# EAGLE design GMSN Pure Power (EAGLE 8.2.1)
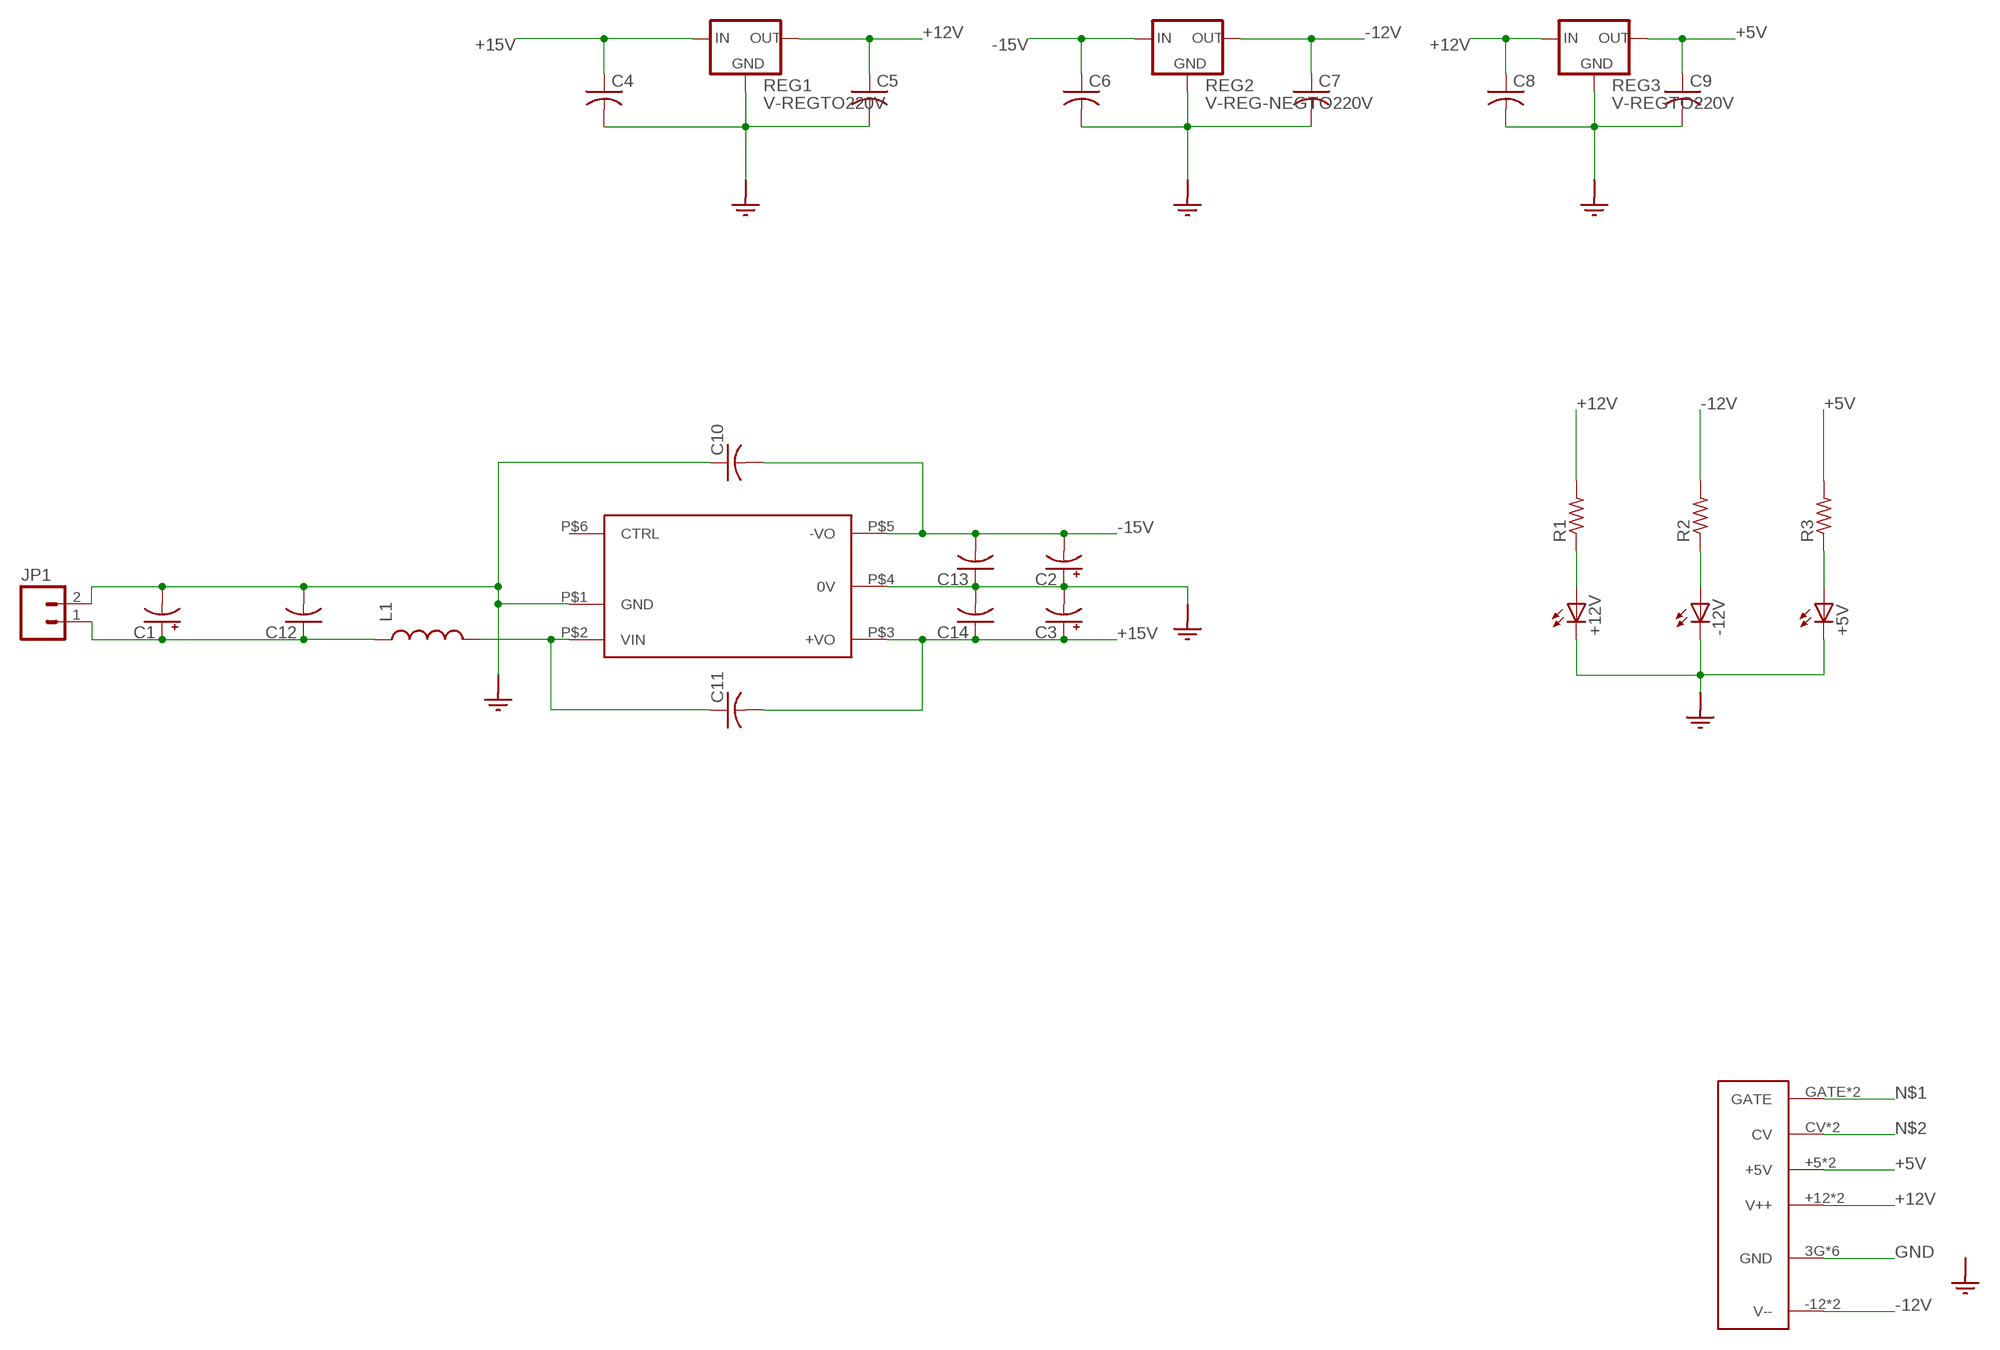
[diagram p0: schematic, sheet 1]

## Parts
+5V  LED5MM  [LED5MM]
+12V  LED5MM  [LED5MM]
-12V  LED5MM  [LED5MM]
C1  CPOL-USSANYO_D  [SANYO-OSCON_D]
C2  CPOL-USSANYO_D  [SANYO-OSCON_D]
C3  CPOL-USSANYO_D  [SANYO-OSCON_D]
C4  C-US025-024X044  [C025-024X044]
C5  C-US025-024X044  [C025-024X044]
C6  C-US025-024X044  [C025-024X044]
C7  C-US025-024X044  [C025-024X044]
C8  C-US025-024X044  [C025-024X044]
C9  C-US025-024X044  [C025-024X044]
C10  C-US025-024X044  [C025-024X044]
C11  C-US025-024X044  [C025-024X044]
C12  C-US025-024X044  [C025-024X044]
C13  C-US025-024X044  [C025-024X044]
C14  C-US025-024X044  [C025-024X044]
JP1  M02LOCK  [1X02_LOCK]
L1  INDUCTORAXIAL-0.6  [AXIAL-0.6]
R1  R-US_0207/10  [0207/10]
R2  R-US_0207/10  [0207/10]
R3  R-US_0207/10  [0207/10]
REG1  V-REGTO220V  [TO220V]
REG2  V-REG-NEGTO220V  [TO220V]
REG3  V-REGTO220V  [TO220V]
U$1  URA241XLD-20WR3  [URA241XLD-20WR3]
U$11  EURO_POWER_16  [POWER_SHROUDED]

## Nets
+5V: C9.1 R3.2 REG3.3(OUT) U$11.+5(+5V) U$11.+5A(+5V)
+12V: C5.1 C8.1 R1.2 REG1.3(OUT) REG3.1(IN) U$11.+12(V++) U$11.+12A(V++)
+15V: C3.+ C4.1 C11.2 C14.1 REG1.1(IN) U$1.P$3(+VO)
-12V: C7.1 R2.2 REG2.3(OUT) U$11.-12(V--) U$11.-12A(V--)
-15V: C2.- C6.1 C10.2 C13.2 REG2.2(IN) U$1.P$5(-VO)
GND: +5V.K(C) +12V.K(C) -12V.K(C) C1.- C2.+ C3.- C4.2 C5.2 C6.2 C7.2 C8.2 C9.2 C10.1 C12.2 C13.1 C14.2 JP1.2 REG1.2(GND) REG2.1(GND) REG3.2(GND) U$1.P$1(GND) U$1.P$4(0V) U$11.3G(GND) U$11.4G(GND) U$11.5G(GND) U$11.6G(GND) U$11.7G(GND) U$11.8G(GND)
N$1: U$11.GATE U$11.GATEA(GATE)
N$2: U$11.CV U$11.CVA(CV)
N$3: C11.1 L1.P$2 U$1.P$2(VIN)
N$4: +12V.A R1.1
N$5: -12V.A R2.1
N$6: +5V.A R3.1
N$7: C1.+ C12.1 JP1.1 L1.P$1
Unconnected: U$1.P$6(CTRL)

## Library data of the parts
+5V +12V -12V = GMSN:LED: LED OSRAM: - CHIPLED LG R971, LG N971, LY N971, LG Q971, LY Q971, LO R971, LY R971 LH N974, LH R974 LS Q976, LO Q976, LY Q976 LO Q996 - Hyper CHIPLED LW Q18S LB Q993, LB Q99A, LB R99A - SideLED LS A670, LO A670, LY A670, LG A670, LP A670 LB A673, LV A673, LT A673, LW A673 LH A674 LY A675 LS A676, LA A676, LO A676, LY A676, LW A676 LS A679, LY A679, LG A679 - Hyper Micro SIDELED® LS Y876, LA Y876, LO Y876, LY Y876 LT Y87S - SmartLED LW L88C, LW L88S LB L89C, LB L89S, LG L890 LS L89K, LO L89K, LY L89K LS L896, LA L896, LO L896, LY L896 - TOPLED LS T670, LO T670, LY T670, LG T670, LP T670 LSG T670, LSP T670, LSY T670, LOP T670, LYG T670 LG T671, LOG T671, LSG T671 LB T673, LV T673, LT T673, LW T673 LH T674 LS T676, LA T676, LO T676, LY T676, LB T676, LH T676, LSB T676, LW T676 LB T67C, LV T67C, LT T67C, LS T67K, LO T67K, LY T67K, LW E67C LS E67B, LA E67B, LO E67B, LY E67B, LB E67C, LV E67C, LT E67C LW T67C LS T679, LY T679, LG T679 LS T770, LO T770, LY T770, LG T770, LP T770 LB T773, LV T773, LT T773, LW T773 LH T774 LS E675, LA E675, LY E675, LS T675 LS T776, LA T776, LO T776, LY T776, LB T776 LHGB T686 LT T68C, LB T68C - Hyper Mini TOPLED® LB M676 - Mini TOPLED Santana® LG M470 LS M47K, LO M47K, LY M47K Source: http://www.osram.convergy.de/
C1-C3 = GMSN:CPOL-US: POLARIZED CAPACITOR, American symbol
C4-C14 = GMSN:C-US: CAPACITOR, American symbol
JP1 = GMSN:M02: Standard 2-pin 0.1" header. Use with - straight break away headers ( PRT-00116) - right angle break away headers (PRT-00553) - swiss pins (PRT-00743) - machine pins (PRT-00117) - female headers (PRT-00115) Molex polarized connector foot print use with: PRT-08233 with associated crimp pins and housings. 2.54_SCREWTERM for use with PRT-10571. 3.5mm Screw Terminal footprints for PRT-08084 5mm Screw Terminal footprints for use with PRT-08433
L1 = GMSN:INDUCTOR: Inductors Basic Inductor/Choke - 0603 and 1206. Footprints are not proven and vary greatly between part numbers. SRN6045- 33uH, 20% 1.4A
R1-R3 = GMSN:R-US_: RESISTOR, American symbol
REG1 REG3 = GMSN:V-REG
REG2 = GMSN:V-REG-NEG
U$1 = GMSN:URA241XLD-20WR3
U$11 = GMSN:EURO_POWER_16

## Board
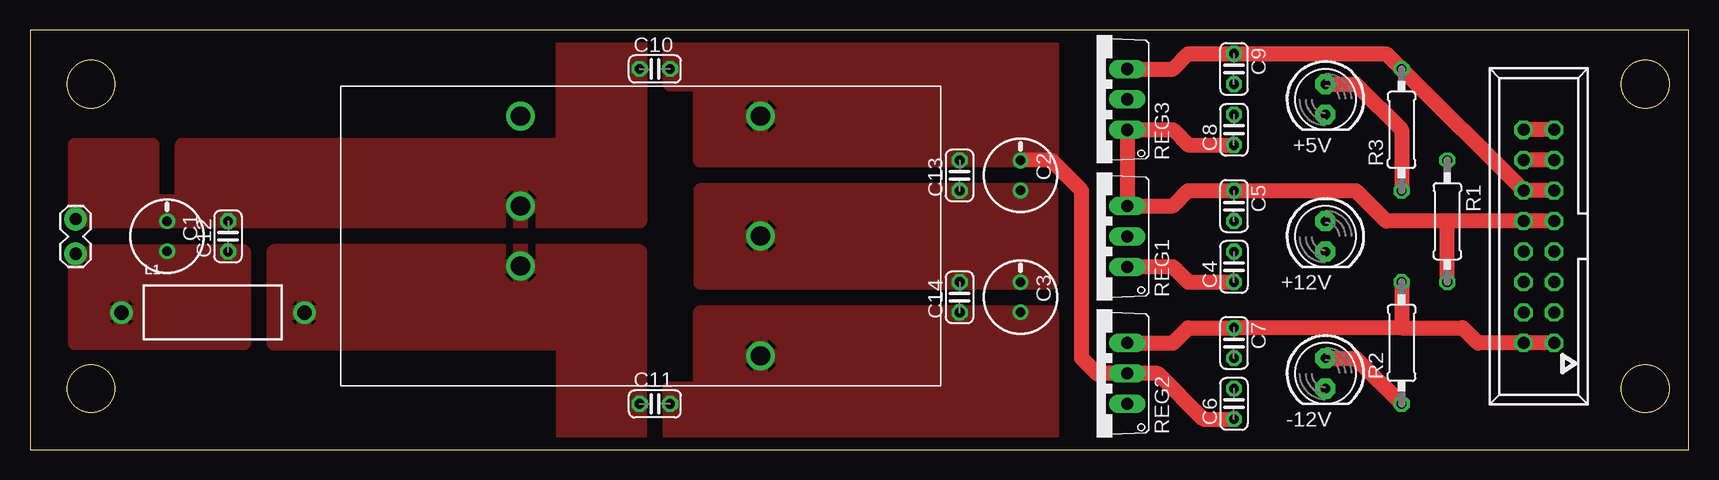
[diagram p1: board, top side]
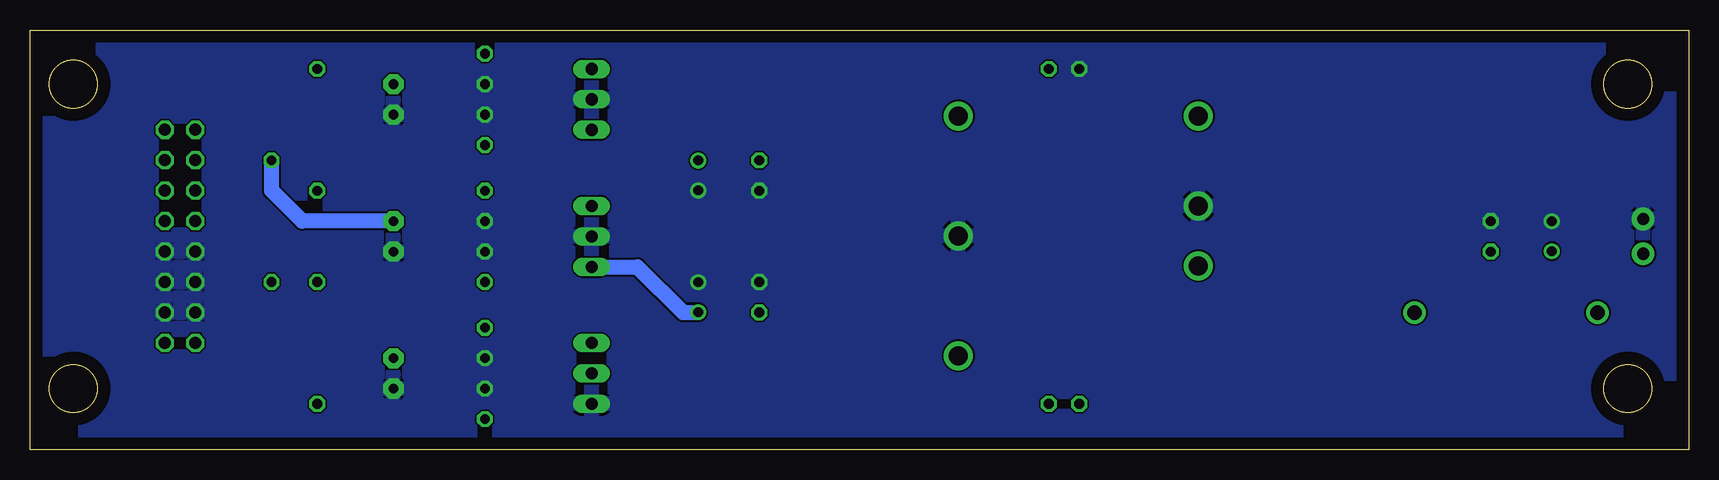
[diagram p2: board, bottom side, seen from below]

Size 138.24 x 35 mm. Coordinates in mm from the lower left corner, seen from the top.
Outline: 0,0 138.24,0 138.24,35 0,35 0,0
Outline: circle at 5.08,30.48 radius 2
Outline: circle at 5.08,5.08 radius 2
Outline: circle at 134.62,30.48 radius 2
Outline: circle at 134.62,5.08 radius 2
Copper layers (1*16): Top 0.035mm / dielectric 1.5mm / Bottom 0.035mm
Design rules "default": minimum track width 6mil, minimum drill 0.35mm, track to track 6mil, track to pad 6mil, pad to pad 6mil, via to via 6mil, smd to smd 6mil, copper to edge 40mil, drill to drill 6mil, minimum pad ring 10mil, minimum via ring 8mil, stop-mask expansion 4mil, vias tented up to drill 0mil, thermal gap 10mil

### Footprints (pad centres in the part's own frame; a part is rotated, then mirrored left to right if it is on the bottom)
LED5MM = drill 0.813 pad 1.676 octagon: A -1.27,0; K 1.27,0
SANYO-OSCON_D = drill 0.8 pad 1.27: + 1.25,0; - -1.25,0
C025-024X044 = drill 0.813 octagon: 1 -1.27,0; 2 1.27,0
1X02_LOCK = drill 1.016 pad 1.88: 1 -0.178,0; 2 2.718,0
AXIAL-0.6 = drill 1.2 pad 1.88: P$1 -7.62,0; P$2 7.62,0
0207/10 = drill 0.813 octagon: 1 -5.08,0; 2 5.08,0
TO220V = drill 1.016 long: 1 -2.54,-2.54; 2 0,-2.54; 3 2.54,-2.54
URA241XLD-20WR3 = drill 1.6: P$1 -15,0; P$2 -15,-5; P$3 5,-12.5; P$4 5,-2.5; P$5 5,7.5; P$6 -15,7.5
POWER_SHROUDED = drill 1 octagon: 3G -6.35,-1.27; 4G -6.35,1.27; 5G -3.81,-1.27; 6G -3.81,1.27; 7G -1.27,-1.27; 8G -1.27,1.27; +5 3.81,-1.27; +5A 3.81,1.27; +12 1.27,-1.27; +12A 1.27,1.27; -12 -8.89,-1.27; -12A -8.89,1.27; CV 6.35,-1.27; CVA 6.35,1.27; GATE 8.89,-1.27; GATEA 8.89,1.27

### Placement (x,y rotation side)
+5V  107.95,29.21 270 top
+12V  107.95,17.78 270 top
-12V  107.95,6.35 270 top
C1  11.43,17.78 270 top
C2  82.55,22.86 270 top
C3  82.55,12.7 270 top
C4  100.33,15.24 90 top
C5  100.33,20.32 270 top
C6  100.33,3.81 90 top
C7  100.33,8.89 270 top
C8  100.33,26.67 90 top
C9  100.33,31.75 270 top
C10  52.07,31.75 0 top
C11  52.07,3.81 0 top
C12  16.51,17.78 90 top
C13  77.47,22.86 90 top
C14  77.47,12.7 90 top
JP1  3.81,16.51 90 top
L1  15.24,11.43 0 top
R1  118.11,19.05 270 top
R2  114.3,8.89 90 top
R3  114.3,26.67 90 top
REG1  88.9,17.78 90 top
REG2  88.9,6.35 90 top
REG3  88.9,29.21 90 top
U$1  55.88,20.32 0 top
U$11  125.73,17.78 90 top

### Tracks (layer width: path | path; a pad name or v marks a point on that pad's centre or on a via)
+5V
  Top 1.27: REG3.3 95.25,31.75 96.52,33.02 C9.1 113.03,33.02 R3.2 U$11.+5A U$11.+5
+12V
  Top 1.27: C8.1 96.52,25.4 95.25,26.67 REG3.1 REG1.3 95.25,20.32 96.52,21.59 C5.1 110.49,21.59 113.03,19.05 118.11,19.05 | R1.2 118.11,19.05 | U$11.+12 U$11.+12A 118.11,19.05
+15V
  Top 1.27: REG1.1 95.25,15.24 96.52,13.97 C4.1
  Bottom 1.27: REG1.1 87.63,15.24 83.82,11.43 82.55,11.43 C3.+
  pour Top: 55.88,11.43 85.09,11.43 85.09,-1.27 53.34,-1.27 53.34,5.08 55.88,5.08
-12V
  Top 1.27: REG2.3 95.25,8.89 96.52,10.16 C7.1 114.3,10.16 | 114.3,10.16 119.38,10.16 120.65,8.89 U$11.-12A U$11.-12 | R2.2 114.3,10.16
-15V
  Top 1.27: C6.1 97.79,2.54 93.98,6.35 REG2.2 88.9,6.35 87.63,7.62 87.63,21.59 85.09,24.13 82.57,24.13 C2.-
  pour Top: 85.09,34.29 85.09,24.13 55.88,24.13 55.88,30.48 53.34,30.48 53.34,34.29
GND
  pour Bottom: -2.54,35.56 142.24,35.56 142.24,-1.27 -2.54,-1.27
  pour Top: 50.8,34.29 50.8,19.05 3.81,19.05 3.81,25.4 10.16,25.4 10.16,20.7 12.7,20.7 12.7,25.4 44.45,25.4 44.45,34.29
  pour Top: 55.88,21.59 55.88,13.97 85.09,13.97 85.09,21.59
N$1
  Top 1.27: U$11.GATE U$11.GATEA
N$2
  Top 1.27: U$11.CV U$11.CVA
N$3
  pour Top: 50.8,-1.27 50.8,16.51 20.32,16.51 20.32,8.89 44.45,8.89 44.45,-1.27
N$4
  Bottom 1.27: +12V.A 115.57,19.05 118.11,21.59 R1.1
N$5
  Top 1.27: -12V.A 110.49,7.62 R2.1
N$6
  Top 1.27: +5V.A 110.49,30.48 114.3,26.67 R3.1
N$7
  pour Top: 3.81,16.51 17.78,16.51 17.78,8.89 3.81,8.89